# Altium schematic sheet Power.SchDoc
size A
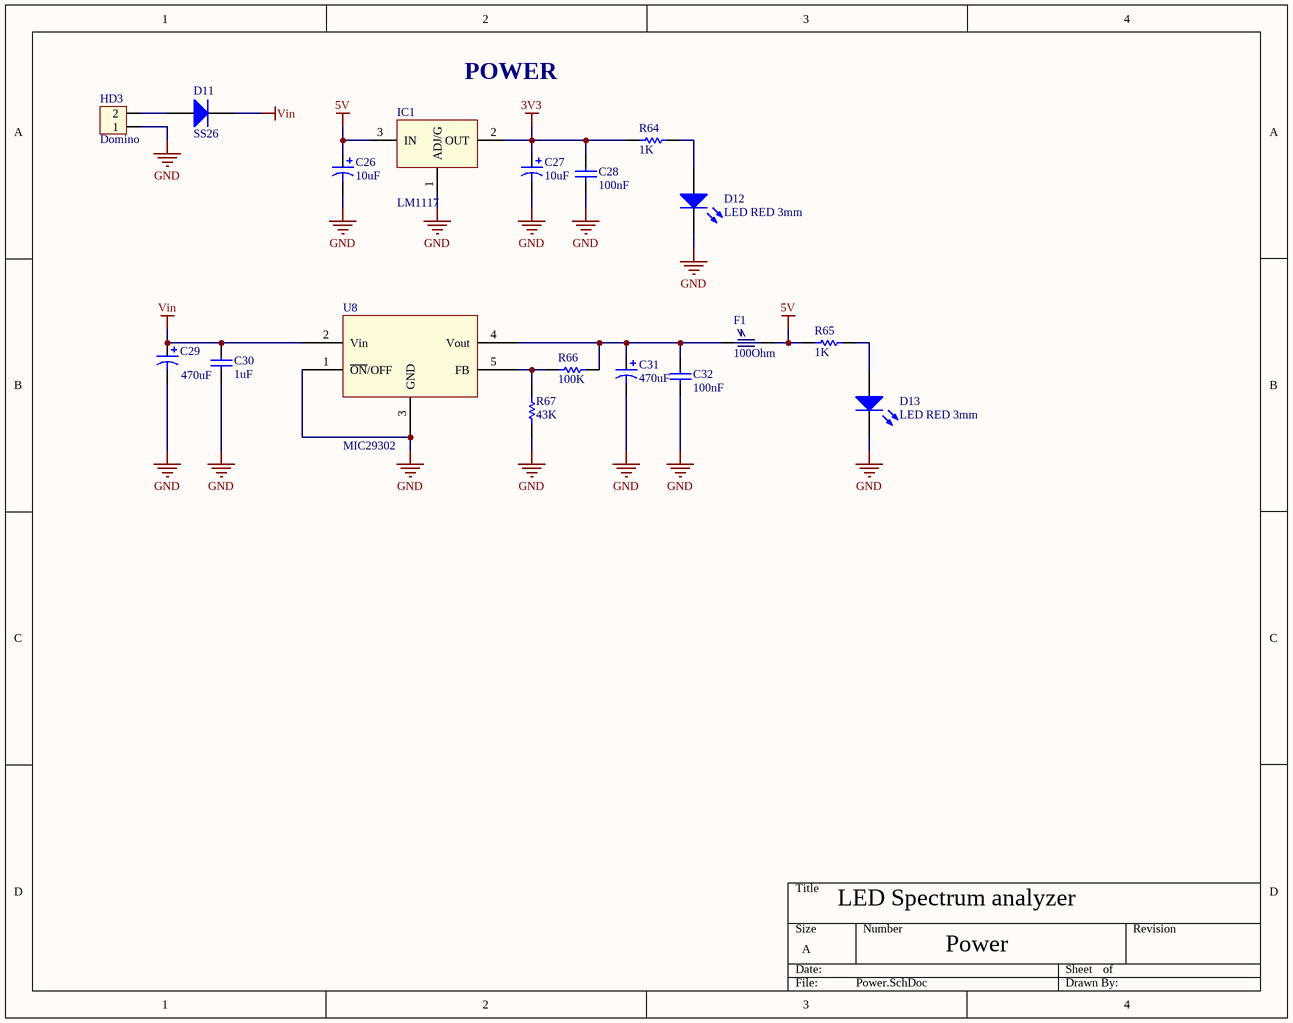
[diagram p0: Power.SchDoc]

## Parts
C26  10uF  [Cap size C]
C27  10uF  [Cap size C]
C28  100nF  [C0805]
C29  470uF  [Cap size X]
C30  1uF  [C0805]
C31  470uF  [Cap size X]
C32  100nF  [C0805]
D11  SS26  [DO-214AA SMB]
D12  LED RED 3mm  [led0805]
D13  LED RED 3mm  [led0805]
F1  100Ohm  [BL02RN1]
HD3  Domino  [HED2]
IC1  LM1117  [SOT223-4N]
R64  1K  [R0805]
R65  1K  [R0805]
R66  100K  [R0805]
R67  43K  [R0805]
U8  MIC29302  [TO-263 5pin]

## Nets
3V3: C27.1(+) C28.2 IC1.2(OUT) R64.2
5V: C26.1(+) F1.2(out) IC1.3(IN) R65.2
GND: C26.2(-) C27.2(-) C28.1 C29.2 C30.1 C31.2(-) C32.1 D12.2(K) D13.2(K) HD3.1 IC1.1(ADJ/G) R67.1 U8.1(~{ON}/OFF) U8.3(GND) U8.6(TAP)
Vin: C29.1 C30.2 D11.2(K) U8.2(Vin)
NetC31_1: C31.1(+) C32.2 F1.1(in) R66.1 U8.4(Vout)
NetD11_1: D11.1(A) HD3.2
NetD12_1: D12.1(A) R64.1
NetD13_1: D13.1(A) R65.1
NetR66_2: R66.2 R67.2 U8.5(FB)

## Notes on the sheet
- POWER
- LED Spectrum analyzer
- Power

## Library data of the parts
C26 C27 C31 = 10uF/25V/RADIAL 5X11/20%: Aluminum Electrolytic Capacitors - Leaded 10uF 25V; Manufacturer: Panasonic; Manufacturer Part Number: ECA-1EM100; Tolerance: 20 %; Type: Radial Lead Type; Life: 2000 Hour; Ripple Current: 50 mA; Supplier 1: Mouser; RoHS: RoHS Compliant; Category: Aluminum Electrolytic Capacitors - Leaded; Stock 1: 19378; Pricing 1: 1=0.288, 10=0.117, 100=0.069, 1000=0.061, 2500=0.053, 10000=0.050, 25000=0.048, 50000=0.045 (AUD); Capacitance: 10 uF; Diameter: 5 mm; Dimensions: 5 mm Dia. x 11 mm L; Length: 11 mm; Package / Case: Radial, Can; Packaging: Bulk; Product: General Purpose Electrolytic Capacitors; Series: M; Termination Style: Radial; Voltage Rating DC: 25 V; Brand: Panasonic; Lead Spacing: 2 mm; Lead Style: Straight; Maximum Operating Temperature: + 85 C; Product Category: Radial Electrolytic Aluminum Capacitors; Standard Pack Qty: 200; RoHS - Mouser: Y; Minimum Order Quantity: 1; Reeling: False; ComponentLink1URL: http://www.mouser.com/ds/2/315/ABA0000CE12-465472.pdf; ComponentLink1Description: http://www.mouser.com/ds/2/315/ABA0000CE12-465472.pdf
C28 C30 C32 = 0.1uF/25V/C0603/10%: CAP CER 0.1UF 25V 10% X7R 0603; Manufacturer: Murata Electronics North America; Manufacturer Part Number: GRM188R71E104KA01D; Capacitance: 0.1µF; Supplier 1: Digi-Key; RoHS: RoHS Compliant; Category: Capacitors; Stock 1: 8148157; Pricing 1: 1=0.1, 10=0.019, 50=0.0104, 100=0.0088, 250=0.0072, 500=0.00616, 1000=0.0048 (USD); Packaging: Cut Tape (CT); Tolerance: ±10%; Voltage - Rated: 25V; Temperature Coefficient: X7R; Mounting Type: Surface Mount, MLCC; Operating Temperature: -55°C ~ 125°C; Applications: General Purpose; Ratings: -; Package / Case: 0603 (1608 Metric); Size / Dimension: 0.063" L x 0.031" W (1.60mm x 0.80mm); Height - Seated (Max): -; Thickness (Max): 0.035" (0.90mm); Lead Spacing: -; Features: -; Lead Style: -; ComponentLink1URL: http://www.murata.com/~/media/webrenewal/support/library/catalog/products/capacitor/mlcc/c02e.ashx; ComponentLink1Description: http://www.murata.com/~/media/webrenewal/support/library/catalog/products/capacitor/mlcc/c02e.ashx
C29 = 220uF/50V/RADIAL 8X11.5/20%: CAP ALUM 220UF 20% 50V RADIAL; Manufacturer: Panasonic Electronic Components; Manufacturer Part Number: EEU-EB1H221; Capacitance: 220µF; Lifetime @ Temp.: 10000 Hrs @ 105°C; Ripple Current: 234mA; Supplier 1: Digi-Key; RoHS: RoHS Compliant; Category: Capacitors; Stock 1: 15029; Pricing 1: 1=0.72, 10=0.51, 25=0.4356, 50=0.3858, 100=0.336, 250=0.2862, 500=0.24888, 1000=0.2074, 2500=0.1952 (USD); Packaging: Bulk; Tolerance: ±20%; Voltage Rating: 50V; ESR (Equivalent Series Resistance): -; Operating Temperature: -40°C ~ 105°C; Type: -; Applications: General Purpose; Impedance: -; Lead Spacing: 0.197" (5.00mm); Size / Dimension: 0.394" Dia (10.00mm); Height - Seated (Max): 0.630" (16.00mm); Surface Mount Land Size: -; Mounting Type: Through Hole; Package / Case: Radial, Can; ComponentLink1URL: http://media.digikey.com/pdf/Data%20Sheets/Panasonic%20Electronic%20Components/EB_Series_Rev2013.pdf; ComponentLink1Description: http://media.digikey.com/pdf/Data%20Sheets/Panasonic%20Electronic%20Components/EB_Series_Rev2013.pdf; Supplier Part Number 1: P13131-ND
D11 = Diode 1N4007: 1 Amp General Purpose Rectifier; Muf: Vishay/USA; Property: Diode; Ordering: SS26; Price: 0.51RMB; Des: *
D12 D13 = LED RED 3mm: LED RED DIFFUSED 3MM ROUND; Manufacturer: Panasonic Electronic Components; Manufacturer Part Number: LN28RPX; Wavelength - Peak: 700nm; Millicandela Rating: 2.8mcd; Voltage - Forward (Vf) (Typ): 2.2V; Current - Test: 15mA; Lens Style/Size: Round with Domed Top, 3mm (T-1), 3.00mm; Supplier 1: Digi-Key; RoHS: RoHS Compliant; Category: Diode; Stock 1: 133031; Pricing 1: 1=0.43, 10=0.339, 25=0.2864, 100=0.233, 250=0.19304, 500=0.15974, 1000=0.11981, 2500=0.10982, 5000=0.10317 (USD); Packaging: Bulk; Color: Red; Wavelength - Dominant: -; Viewing Angle: -; Lens Transparency: Diffused; Lens Color: Red; Package / Case: Radial; Supplier Device Package: 3mm Round; Size / Dimension: -; Height (Max): 5.70mm; Mounting Type: Through Hole; ComponentLink1URL: http://industrial.panasonic.com/www-cgi/jvcr13pz.cgi?E+SC+4+ATA7001+LN28RPX+8+WW; ComponentLink1Description: http://industrial.panasonic.com/www-cgi/jvcr13pz.cgi?E+SC+4+ATA7001+LN28RPX+8+WW; Supplier Part Number 1: P563-ND
F1 = Ferrite EMI: Dec: EMI Suppression Filters  (Lead Type EMIFIL); Muf: Murata/Japan; Ordering: BL02RN1R2M2B; Property: EMI Fliter
HD3 = Hed2: Header 2 (Green); Value: Header 2
IC1 = LM1117: Available in 1.8V, 2.5V, 2.85V, 3.3V, 5V, and  Adjustable Versions; Value: LM317
R64-R67 = 1K/R0805/1%: RES SMD 1K OHM 1% 1/8W 0805; Manufacturer: Yageo; Manufacturer Part Number: RC0805FR-071KL; Power (Watts): 0.125W, 1/8W; Temperature Coefficient: ±100ppm/°C; Supplier 1: Digi-Key; RoHS: RoHS Compliant; Category: Resistors; Stock 1: 2365000; Pricing 1: 5000=0.00247, 10000=0.00215, 25000=0.00189, 50000=0.00173, 125000=0.00169 (USD); Packaging: Tape & Reel (TR); Resistance (Ohms): 1k; Tolerance: ±1%; Composition: Thick Film; Features: Moisture Resistant; Operating Temperature: -55°C ~ 155°C; Package / Case: 0805 (2012 Metric); Supplier Device Package: 0805; Size / Dimension: 0.079" L x 0.049" W (2.00mm x 1.25mm); Height: 0.024" (0.60mm); Number of Terminations: 2; ComponentLink1URL: http://www.yageo.com/NewPortal/yageodocoutput?fileName=/pdf/R-Chip/PYu-RC_Group_51_RoHS_L_3.pdf; ComponentLink1Description: http://www.yageo.com/NewPortal/yageodocoutput?fileName=/pdf/R-Chip/PYu-RC_Group_51_RoHS_L_3.pdf; Supplier Part Number 1: 311-1.00KCRTR-ND
U8 = MIC29302: High-Current Low-Dropout Regulators